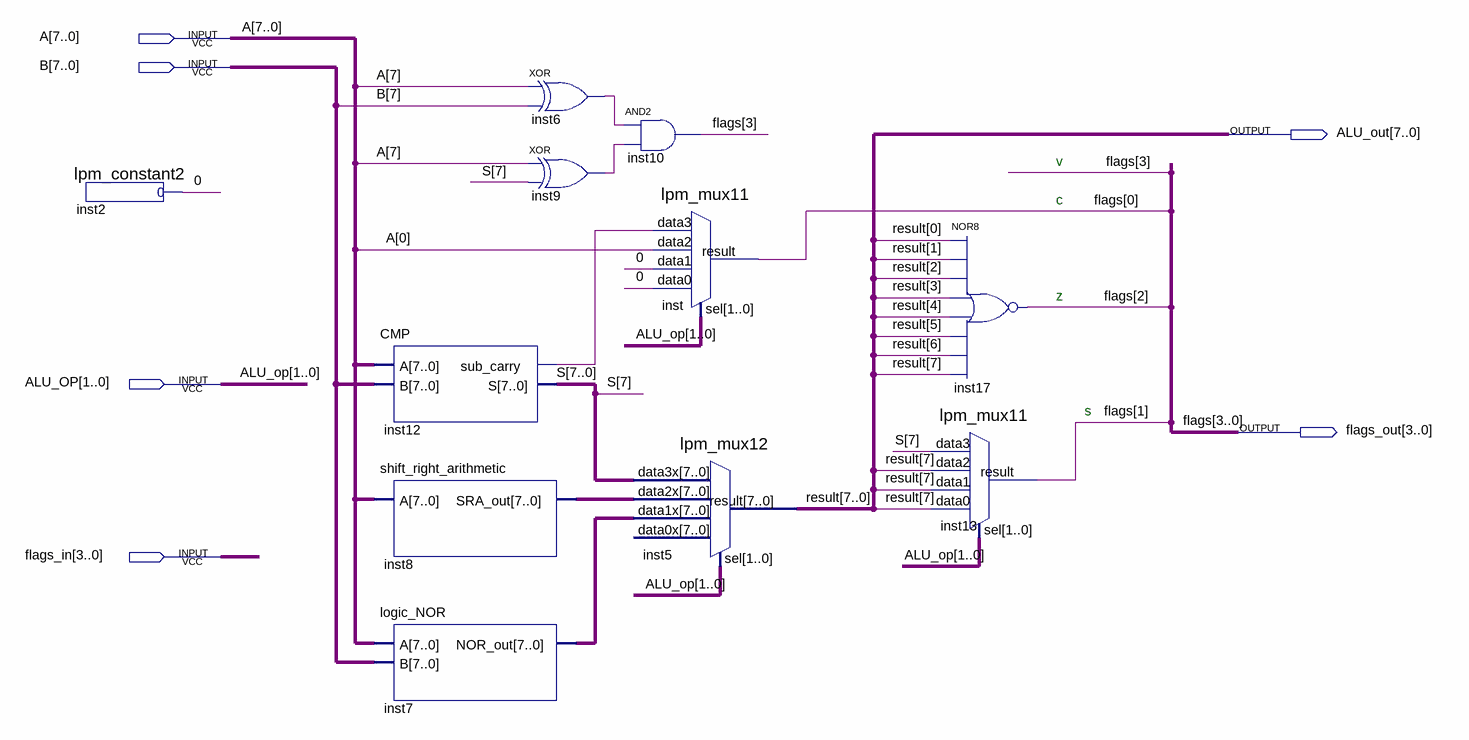
[diagram p0: schematic sheet]
// Quartus schematic arithmetic_logic_unit.bdf as structural Verilog: 11 symbols, 6 pins
module arithmetic_logic_unit (
  input  [7:0] A,
  input  [7:0] B,
  input  [1:0] ALU_OP,
  input  [3:0] flags_in,
  output [7:0] ALU_out,
  output [3:0] flags_out
);

  wire \0 , inst6_out, inst9_out, inst12_sub_carry;
  wire [7:0] inst7_nor_out, inst8_sra_out, S;

  lpm_constant2 inst2 (.result(\0 ));
  CMP inst12 (.A(A), .B(B), .sub_carry(inst12_sub_carry), .S(S));
  shift_right_arithmetic inst8 (.A(A), .SRA_out(inst8_sra_out));
  logic_NOR inst7 (.A(A), .B(B), .NOR_out(inst7_nor_out));
  xor inst6 (inst6_out, A[7], B[7]);
  xor inst9 (inst9_out, A[7], S[7]);
  and inst10 (flags_out[3], inst6_out, inst9_out);
  lpm_mux11 inst (
    .data3(inst12_sub_carry), .data2(A[0]), .data1(\0 ), .data0(\0 ), .sel(ALU_OP), .result(flags_out[0]));
  lpm_mux12 inst5 (
    .data3x(S), .data2x(inst8_sra_out), .data1x(inst7_nor_out), .sel(ALU_OP), .result(ALU_out));  // open: data0x
  nor inst17 (flags_out[2], ALU_out[0], ALU_out[1], ALU_out[2], ALU_out[3], ALU_out[4], ALU_out[5], ALU_out[6], ALU_out[7]);
  lpm_mux11 inst13 (
    .data3(S[7]), .data2(ALU_out[7]), .data1(ALU_out[7]), .data0(ALU_out[7]), .sel(ALU_OP),
    .result(flags_out[1]));

  // Other names for the same wires on the sheet: result[7:0] = ALU_out; flags[3:0] = flags_out

  // Notes on the sheet:
  //   v
  //   c
  //   z
  //   s
endmodule
